# EAGLE design Carloop-v2.3 (EAGLE 7.5.0)
DATABASE: /home/monkbroc/Electronics/eagle/PARTSDB.tsv
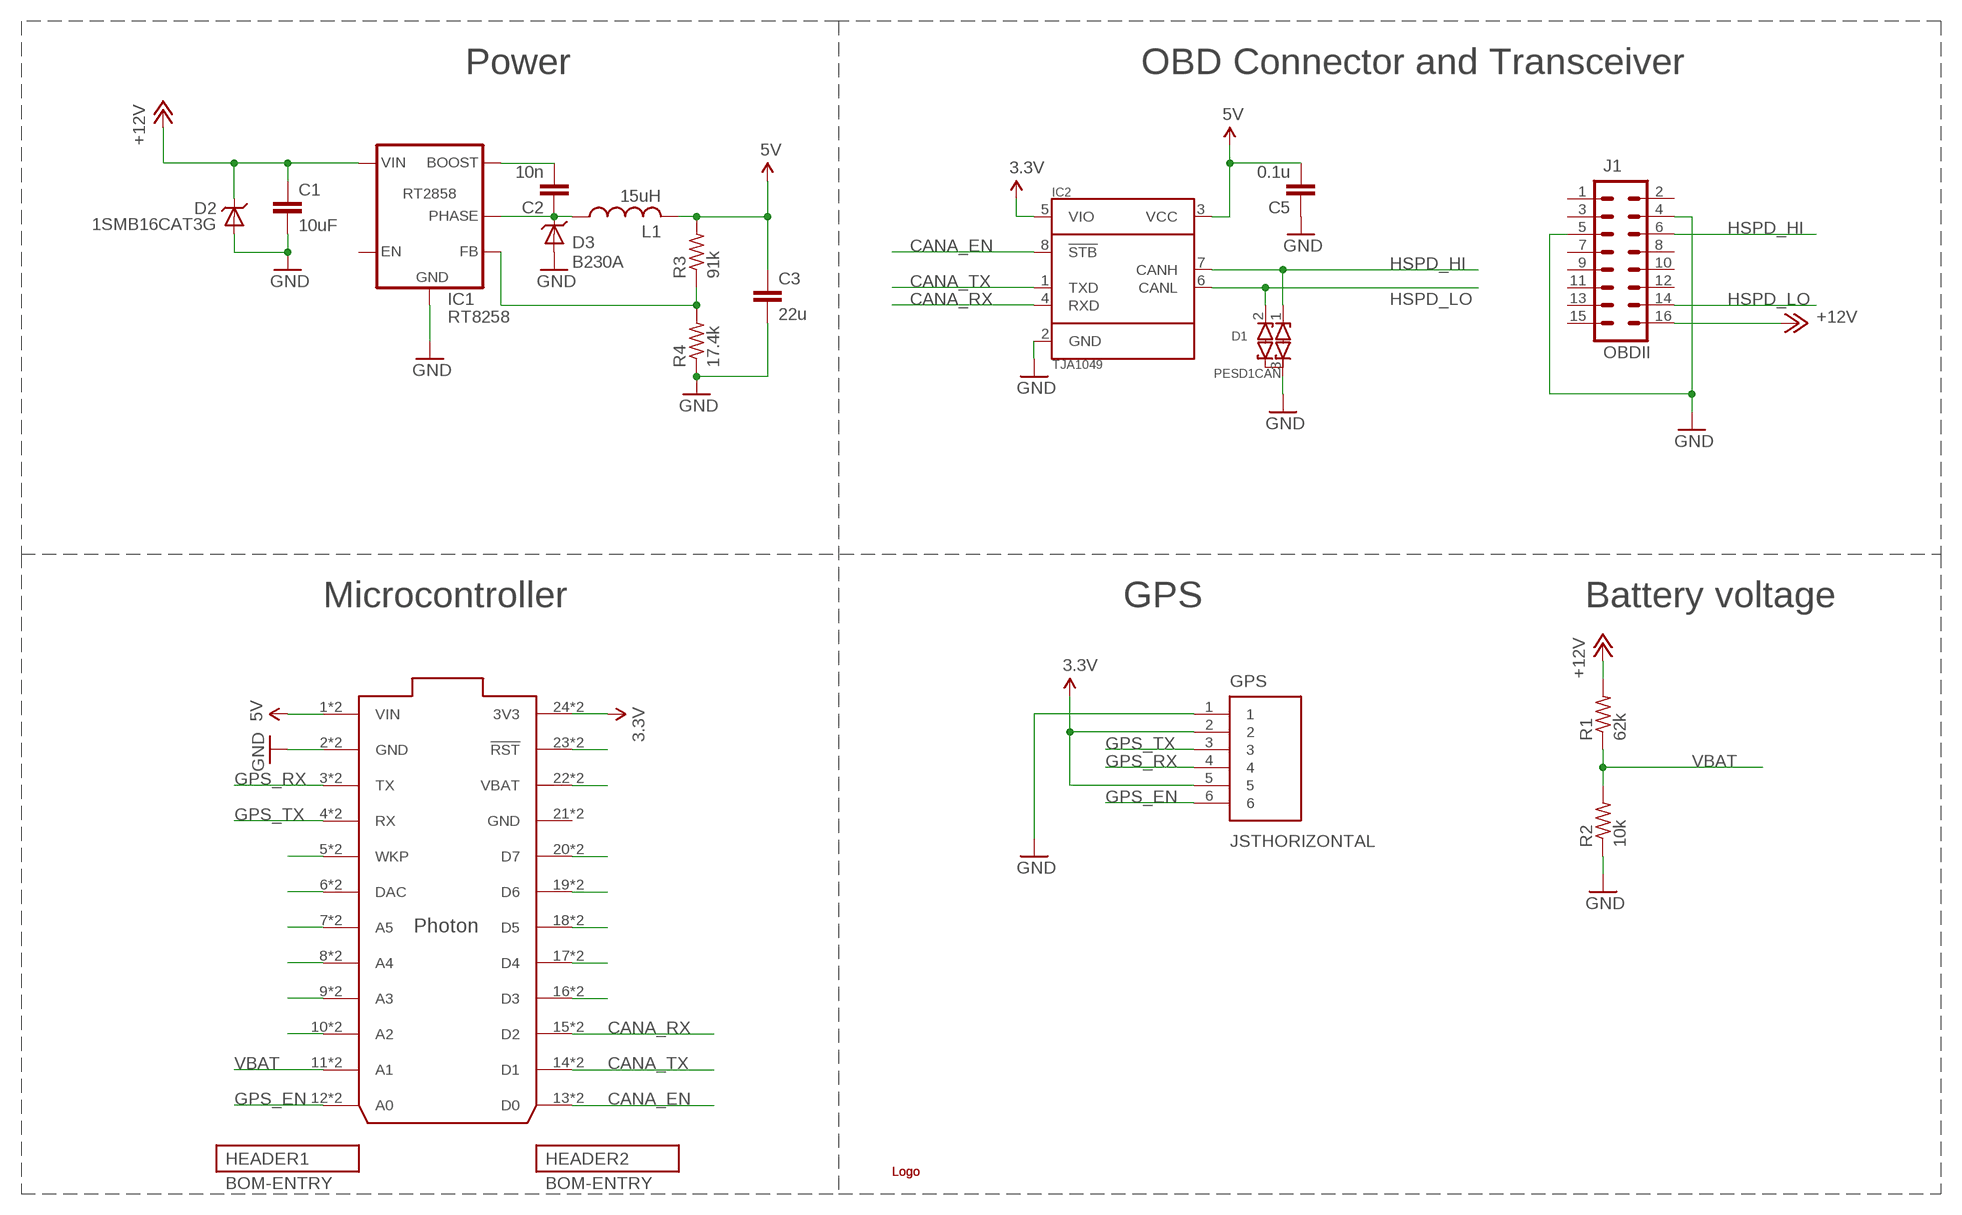
[diagram p0: schematic, sheet 1]
HEADER1 (BOM-ENTRY): PARTNO: PPPC122LFBN-RC
HEADER2 (BOM-ENTRY): PARTNO: PPPC122LFBN-RC

## Parts
C1  10uF  C-EUC1206  [C1206]
C2  10n  C-EUC0402  [C0402]
C3  22u  C-EUC1206  [C1206]
C5  0.1u  C-EUC0402  [C0402]
CORE  PHOTONWITH_EXTERNAL_HEADERS  [PHOTON_STACKABLE_EXTERNAL]
D1  PESD1CAN  DIODE_ESD_DUAL-SOT-23  [SOT23]
D2  1SMB16CAT3G  DIODE-TVS-SMB  [SMB-DIODE]
D3  B230A  DIODE-SCHOTTKY  [DO-214AA]
GPS  JSTHORIZONTAL  [JST-6-SMD-HOR-1.0MM]
IC1  RT8258  [SOT-23-6]
IC2  TJA1049  [SO8]
J1  OBDII  M08X2STRAIGHT  [OBDII-STRAIGHT]
L1  15uH  L-US  [NR8040]
R1  62k  R-US_R0402  [R0402]
R2  10k  R-US_R0402  [R0402]
R3  91k  R-US_R0402  [R0402]
R4  17.4k  R-US_R0402  [R0402]
U$1  LOGOSMALL  [CARLOOP-2]
U$5  LOGOSMALL  [CARLOOP-2]

## Nets
3.3V: CORE.24(3V3) CORE.@24(3V3) GPS.2 GPS.5 IC2.5(VIO)
5V: C3.1 C5.2 CORE.1(VIN) CORE.@1(VIN) IC2.3(VCC) L1.P$2 R3.2
+12V: C1.1 D2.C IC1.5(VIN) J1.16 R1.2
CANA_EN: CORE.13(D0) CORE.@13(D0) IC2.8(!STB)
CANA_RX: CORE.15(D2) CORE.@15(D2) IC2.4(RXD)
CANA_TX: CORE.14(D1) CORE.@14(D1) IC2.1(TXD)
GND: C1.2 C3.2 C5.1 CORE.2(GND) CORE.@2(GND) D1.3(COM) D2.A D3.+(A) GPS.1 IC1.2(GND) IC2.2(GND) J1.4 J1.5 R2.1 R4.1
GPS_EN: CORE.12(A0) CORE.@12(A0) GPS.6
GPS_RX: CORE.3(TX) CORE.@3(TX) GPS.4
GPS_TX: CORE.4(RX) CORE.@4(RX) GPS.3
HSPD_HI: D1.1(C1) IC2.7(CANH) J1.6
HSPD_LO: D1.2(C2) IC2.6(CANL) J1.14
N$1: C2.1 D3.-(C) IC1.6(PHASE) L1.P$1
N$7: C2.2 IC1.1(BOOST)
N$10: CORE.23(!RST) CORE.@23(!RST)
N$11: CORE.22(VBAT) CORE.@22(VBAT)
N$12: CORE.20(D7) CORE.@20(D7)
N$13: CORE.19(D6) CORE.@19(D6)
N$14: CORE.18(D5) CORE.@18(D5)
N$15: CORE.17(D4) CORE.@17(D4)
N$16: CORE.16(D3) CORE.@16(D3)
N$17: IC1.3(FB) R3.1 R4.2
N$19: CORE.10(A2) CORE.@10(A2)
N$20: CORE.9(A3) CORE.@9(A3)
N$23: CORE.8(A4) CORE.@8(A4)
N$24: CORE.7(A5) CORE.@7(A5)
N$25: CORE.6(DAC) CORE.@6(DAC)
N$26: CORE.5(WKP) CORE.@5(WKP)
VBAT: CORE.11(A1) CORE.@11(A1) R1.1 R2.2
Unconnected: IC1.4(EN) J1.1 J1.2 J1.3 J1.7 J1.8 J1.9 J1.10 J1.11 J1.12 J1.13 J1.15

## Notes on the sheet
- Power | OBD Connector and Transceiver
- Microcontroller | GPS | Battery voltage

## Power pins joined to a net without a drawn wire
GND: CORE.21(GND) CORE.@21(GND)

## Library data of the parts
C1 = rcl:C-EU: CAPACITOR, European symbol; PARTNO: GRM31CR61E106KA12L
C2 = rcl:C-EU: CAPACITOR, European symbol; PARTNO: C0402C103K5RACTU
C3 = rcl:C-EU: CAPACITOR, European symbol; PARTNO: GRM31CR61C226ME15L
C5 = rcl:C-EU: CAPACITOR, European symbol; PARTNO: GRM155R71C104KA88D
CORE = MuniRent:PHOTON; BOM: EXCLUDE; PARTNO: *
D1 = MuniRent:DIODE_ESD_DUAL: Dual ESD Diode, with a common anode; PARTNO: PESD1CAN-215
D2 = BUG:DIODE-TVS; PARTNO: 1SMB16CAT3G; ROLE: Overvoltage protection
D3 = MuniRent:DIODE-SCHOTTKY; PARTNO: B230A-13-F
GPS = MuniRent:JST; PARTNO: SM06B-SRSS-TB
IC1 = MuniRent:RT8258; PARTNO: RT8258GJ6
IC2 = MuniRent:TJA1049; PARTNO: TJA1049T-118
J1 = MuniRent:M08X2: .1" headers, two rows of 8 each; PARTNO: OBD-II
L1 = MuniRent:L-US; PARTNO: NR8040T150M
R1 = rcl:R-US_: RESISTOR, American symbol; PARTNO: ERJ-2RKF6202X
R2 = rcl:R-US_: RESISTOR, American symbol; PARTNO: ERJ-2RKF1002X
R3 = rcl:R-US_: RESISTOR, American symbol; PARTNO: ERJ-2RKF9102X
R4 = rcl:R-US_: RESISTOR, American symbol; PARTNO: ERJ-2RKF1742X
U$1 U$5 = MuniRent:LOGO; BOM: EXCLUDE

## Net classes
0 default: width 0.254 mm
1 power: width 0.813 mm, clearance 0.406 mm

## Board
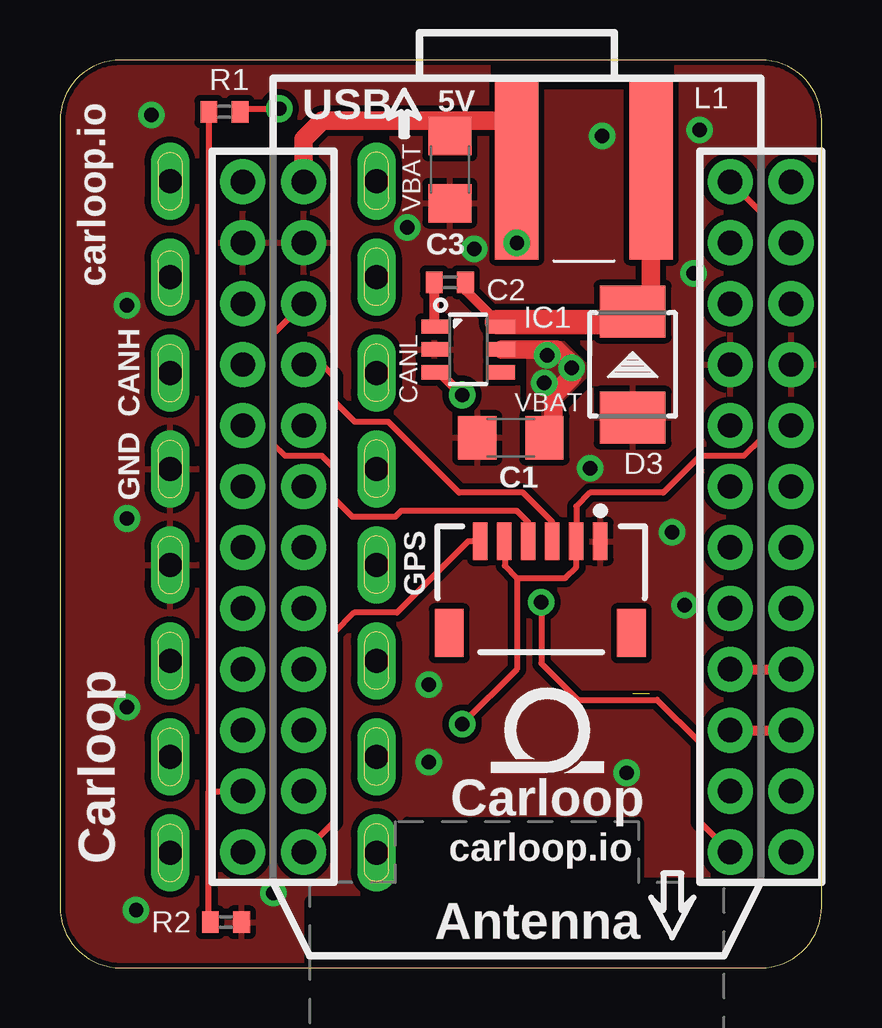
[diagram p1: board, top side]
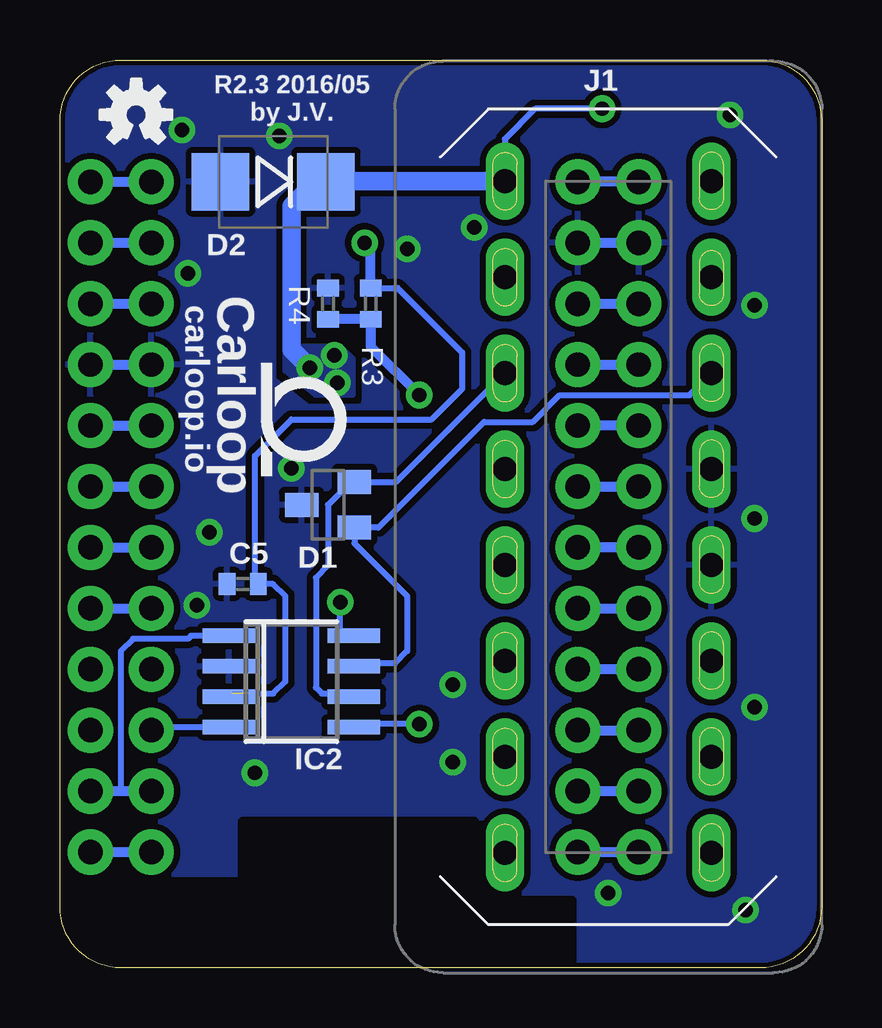
[diagram p2: board, bottom side, seen from below]

Size 31.75 x 37.85 mm. Coordinates in mm from the lower left corner, seen from the top.
Outline: 29.21,37.85 2.54,37.85 arc90 0,35.31 0,2.54 arc90 2.54,0 29.21,0 arc90 31.75,2.54 31.75,35.31 arc90 29.21,37.85
Copper layers (1*16): Top 0.035mm / dielectric 1.5mm / Bottom 0.035mm
Design rules "SparkFun *": minimum track width 8mil, minimum drill 20mil, track to track 10mil, track to pad 8mil, pad to pad 10mil, via to via 10mil, smd to smd 10mil, copper to edge 8mil, drill to drill 8mil, minimum pad ring 12mil, minimum via ring 10mil, stop-mask expansion 4mil, vias tented up to drill 25mil, thermal gap 10mil
tRestrict: area 10.4,-3 to 27.4,6.1; area 18.2,36.8 to 25.4,38
bRestrict: area 10.4,-3 to 27.4,6.1

### Footprints (pad centres in the part's own frame; a part is rotated, then mirrored left to right if it is on the bottom)
C1206 = smd 1.6 x 1.8: 1 -1.4,0; 2 1.4,0
C0402 = smd 0.7 x 0.9: 1 -0.65,0; 2 0.65,0
PHOTON_STACKABLE_EXTERNAL = drill 1.016 pad 1.88: 1 1.27,32.258; 2 1.27,29.718; 3 1.27,27.178; 4 1.27,24.638; 5 1.27,22.098; 6 1.27,19.558; 7 1.27,17.018; 8 1.27,14.478; 9 1.27,11.938; 10 1.27,9.398; 11 1.27,6.858; 12 1.27,4.318; 13 19.05,4.318; 14 19.05,6.858; 15 19.05,9.398; 16 19.05,11.938; 17 19.05,14.478; 18 19.05,17.018; 19 19.05,19.558; 20 19.05,22.098; 21 19.05,24.638; 22 19.05,27.178; 23 19.05,29.718; 24 19.05,32.258; @1 -1.27,32.258; @2 -1.27,29.718; @3 -1.27,27.178; @4 -1.27,24.638; @5 -1.27,22.098; @6 -1.27,19.558; @7 -1.27,17.018; @8 -1.27,14.478; @9 -1.27,11.938; @10 -1.27,9.398; @11 -1.27,6.858; @12 -1.27,4.318; @13 21.59,4.318; @14 21.59,6.858; @15 21.59,9.398; @16 21.59,11.938; @17 21.59,14.478; @18 21.59,17.018; @19 21.59,19.558; @20 21.59,22.098; @21 21.59,24.638; @22 21.59,27.178; @23 21.59,29.718; @24 21.59,32.258
SOT23 = smd 1 x 1.4: 1 -0.95,-1.1; 2 0.95,-1.1; 3 0,1.1
SMB-DIODE = smd 2.4 x 2.4: A 2.2,0; C -2.2,0
DO-214AA = smd 2.159 x 2.743: + -2.21,0; - 2.21,0
JST-6-SMD-HOR-1.0MM = smd 0.6 x 1.55: 1 2.46,1.27; 2 1.46,1.27; 3 0.46,1.27; 4 -0.54,1.27; 5 -1.54,1.27; 6 -2.54,1.27 | smd 1.2 x 2: P$1 -3.84,-2.555; P$2 3.76,-2.555
SOT-23-6 = smd 1.1 x 0.6: 1 -1.4,0.95; 2 -1.4,0; 3 -1.4,-0.95; 4 1.4,-0.95; 5 1.4,0; 6 1.4,0.95
SO8 = smd 0.6 x 2.2: 1 -1.905,-2.6; 2 -0.635,-2.6; 3 0.635,-2.6; 4 1.905,-2.6; 5 1.905,2.6; 6 0.635,2.6; 7 -0.635,2.6; 8 -1.905,2.6
OBDII-STRAIGHT = drill 1 pad 1.5 long: 1 14,4.3; 2 10,4.3; 3 6,4.3; 4 2,4.3; 5 -2,4.3; 6 -6,4.3; 7 -10,4.3; 8 -14,4.3; 9 14,-4.3; 10 10,-4.3; 11 6,-4.3; 12 2,-4.3; 13 -2,-4.3; 14 -6,-4.3; 15 -10,-4.3; 16 -14,-4.3
NR8040 = smd 1.8 x 7.5: P$1 2.8,0; P$2 -2.8,0
R0402 = smd 0.7 x 0.9: 1 -0.65,0; 2 0.65,0

### Placement (x,y rotation side)
C1  18.8,22.1 180 top
C2  16.26,28.58 180 top
C3  16.26,33.27 270 top
C5  24.13,16 0 bottom
CORE  8.89,0.51 0 top
D1  20.57,19.3 90 bottom
D2  22.86,32.77 180 bottom
D3  23.88,25.15 90 top
F2  [OSHW-LOGO-S]  28.57,35.56 0 bottom
GPS  20.07,16.51 0 top
IC1  17.02,25.78 0 top
IC2  22.1,11.94 270 bottom
J1  8.89,18.8 270 bottom
L1  21.84,33.27 0 top
R1  6.86,35.69 0 top
R2  6.92,1.91 180 top
R3  18.8,27.69 90 bottom
R4  20.57,27.69 270 bottom
U$1  20.32,9.91 0 top
U$5  21.59,22.86 270 bottom
ZDRAW1  [A4L-LOC]  -56.39,-53.21 0 top  (outside the outline)

### Tracks (layer width: path | path; a pad name or v marks a point on that pad's centre or on a via)
3.3V  (via drill 0.6)
  Top 0.254: CORE.24 29.21,31.5 29.21,22.05 28.5,21.34 26.67,21.34 25.15,19.81 22.1,19.81 21.53,19.24 GPS.2 21.53,16.7 21.08,16.26 19.05,16.26 | GPS.5 18.54,17.76 18.54,16.76 19.05,16.26 | 19.05,16.26 19.05,12.45 v16.76,10.16
  Bottom 0.254: 19.05,10.03 IC2.5 19.37,10.16 v16.76,10.16
  Bottom 0.406: CORE.@24 CORE.24
5V  (via drill 0.6)  (1 unrouted)
  Top 0.406: 19.3,35.31 19.3,33.27 L1.P$2 v19.05,30.23 | 16.51,35.31 16.26,35.05
  Top 0.762: CORE.1 10.16,34.54 10.92,35.31 15.75,35.31 | 15.75,35.31 16.26,35.31 | 16.26,35.31 16.51,35.31 19.3,35.31 | 16.26,35.05 16.26,35.31 | 16.26,35.31 16,35.05 | C3.1 16.26,34.8 15.75,35.31
  Bottom 0.254: R3.2 17.67,28.34 14.99,25.65 14.99,24.13 16.26,22.86 22.1,22.86 23.62,21.34 23.62,16 C5.2 22.86,16 22.35,15.49 22.35,11.94 22.86,11.43 23.88,11.43 | 24.57,11.43 IC2.3
  Bottom 0.406: CORE.@1 CORE.1 | R3.2 18.8,30.23 v19.05,30.23
+12V  (via drill 0.6)
  Top 0.254: R1.2 7.63,35.81 v9.14,35.81
  Top 0.406: v21.34,25.02 21.34,25.15
  Top 0.762: 21.34,25.15 20.7,25.78 IC1.5 | 20.57,22.98 20.57,23.88 21.34,24.64 v21.34,25.02
  Bottom 0.254: v9.14,35.81 11.94,35.81 13.21,34.54 13.21,32.81 J1.16
  Bottom 0.406: 20.32,32.8 20.57,32.8 20.57,32.85 | 20.57,33.44 20.57,32.85 | 20.57,32.85 D2.C 20.69,32.8 21.05,32.8
  Bottom 0.762: J1.16 20.32,32.8 | 21.05,32.8 22.1,31.75 22.1,25.78 v21.34,25.02
  other vias: 20.32,25.53 20.19,24.38
  pour Bottom (no thermals): 19.56,23.88 21.08,23.88 22.35,24.89 22.35,25.91 20.07,25.91 19.56,25.4
  pour Top: 19.56,26.04 19.56,22.86 20.83,22.86 20.83,23.62 21.84,24.64 21.84,25.15 20.95,26.04
CANA_EN  (via drill 0.6)
  Top 0.254: v20.07,15.24 20.07,12.7 21.59,11.18 24.89,11.18 26.67,9.4 26.67,6.1 CORE.13
  Bottom 0.254: IC2.8 20.07,13.84 v20.07,15.24
  Bottom 0.406: CORE.@13 CORE.13
CANA_RX
  Top 0.406: CORE.15 CORE.@15
  Bottom 0.254: IC2.4 27.81,10.03 CORE.15
CANA_TX
  Bottom 0.254: IC2.1 26.29,13.84 26.42,13.72 28.7,13.72 29.21,13.21 29.21,7.37
  Bottom 0.406: CORE.14 29.21,7.37 CORE.@14
GND  (via drill 0.6)
  Bottom 0.406: CORE.@21 CORE.21 | CORE.2 CORE.@2
  other vias: 2.79,27.62 2.79,18.73 2.79,10.86 3.81,35.56 3.17,2.41 25.53,18.16 23.62,8.13 22.1,20.83 8.89,3.11 15.37,8.57 26.04,15.11 14.48,30.86 22.61,34.67 26.67,34.92 17.27,29.97 15.37,11.81 26.42,28.96
  pour Top (rank 4): 29.21,37.85 2.54,37.85 arc90 0,35.31 0,2.54 arc90 2.54,0 29.21,0 arc90 31.75,2.54 31.75,35.31 arc90
  pour Bottom (rank 4): 29.21,37.85 2.54,37.85 arc90 0,35.31 0,2.54 arc90 2.54,0 29.21,0 arc90 31.75,2.54 31.75,35.31 arc90
GPS_EN
  Top 0.254: GPS.6 17.02,17.78 14.05,14.81 12.27,14.81 11.43,13.97 11.43,6.1 CORE.12
  Bottom 0.406: CORE.12 CORE.@12
GPS_RX
  Top 0.254: GPS.4 19.53,18.57 19.05,19.05 14.22,19.05 13.97,18.8 12.19,18.8 11.43,19.56 11.43,20.83 10.92,21.34 9.4,21.34 8.89,21.84 8.89,26.42 CORE.3
  Bottom 0.406: CORE.3 CORE.@3
GPS_TX
  Top 0.254: GPS.3 20.53,18.59 19.3,19.81 16.64,19.81 13.69,22.76 12.29,22.76 11.43,23.62 11.43,24.64 10.92,25.15 CORE.4
  Bottom 0.406: CORE.4 CORE.@4
HSPD_HI
  Bottom 0.254: D1.1 18.98,18.35 | J1.6 5.51,23.88 10.92,23.88 12.04,22.76 14.07,22.76 18.48,18.35 D1.1 | D1.1 19.47,17.7 17.27,15.49 17.27,13.21 17.78,12.7 19.37,12.7 IC2.7
HSPD_LO
  Bottom 0.254: IC2.6 19.62,11.43 20.83,11.43 21.08,11.68 21.08,16.26 20.57,16.76 20.57,19.3 19.62,20.25 D1.2 17.73,20.25 J1.14
N$1
  Top 0.406: 18.22,26.92 IC1.6 16.91,28.24 C2.1
  Top 0.762: 22.86,26.92 23.44,26.92 D3.- 24.64,28.12 L1.P$1
  Top 1.016: 18.22,26.92 22.86,26.92
N$7
  Top 0.406: 15.87,26.73 IC1.1 C2.2
N$10
  Bottom 0.406: CORE.@23 CORE.23
N$11
  Bottom 0.406: CORE.@22 CORE.22
N$12
  Bottom 0.406: CORE.@20 CORE.20
N$13
  Bottom 0.406: CORE.@19 CORE.19
N$14
  Bottom 0.406: CORE.@18 CORE.18
N$15
  Bottom 0.406: CORE.@17 CORE.17
N$16
  Top 0.406: CORE.16 CORE.@16
N$17  (via drill 0.6)
  Top 0.406: v16.76,23.88 15.81,24.83 IC1.3
  Bottom 0.406: R4.2 R3.1 18.8,25.91 v16.76,23.88
N$19
  Bottom 0.406: CORE.10 CORE.@10
N$20
  Bottom 0.406: CORE.@9 CORE.9
N$23
  Bottom 0.406: CORE.8 CORE.@8
N$24
  Bottom 0.406: CORE.@7 CORE.7
N$25
  Bottom 0.406: CORE.6 CORE.@6
N$26
  Bottom 0.406: CORE.@5 CORE.5
VBAT
  Top 0.254: 6.21,7.37 CORE.@11 | R1.1 6.21,7.37 | R2.2 6.21,1.91 6.21,7.37
  Bottom 0.406: CORE.@11 CORE.11

### Text on the board
tPlace: USB | 5V | carloop.io | VBAT | CANH | CANL | VBAT | GND | Carloop | Carloop | carloop.io | Antenna
bPlace: R2.3 2016/05 / by J.V. | Carloop | carloop.io
Document: NOTES: | Revision 2.3 | Julien Vanier | jvanier@gmail.com
Reference: OBD | connected car kit | Make / apps / for / your / car | 12V | PARTICLE | powered | G / P / S | Make apps / for your | MAKE APPS / FOR YOUR / CAR | MAKE / APPS / FOR / YOUR / CAR | CAR | Make apps / for your car